# EAGLE schematic raspdancer11_1.0 (EAGLE 6.4)
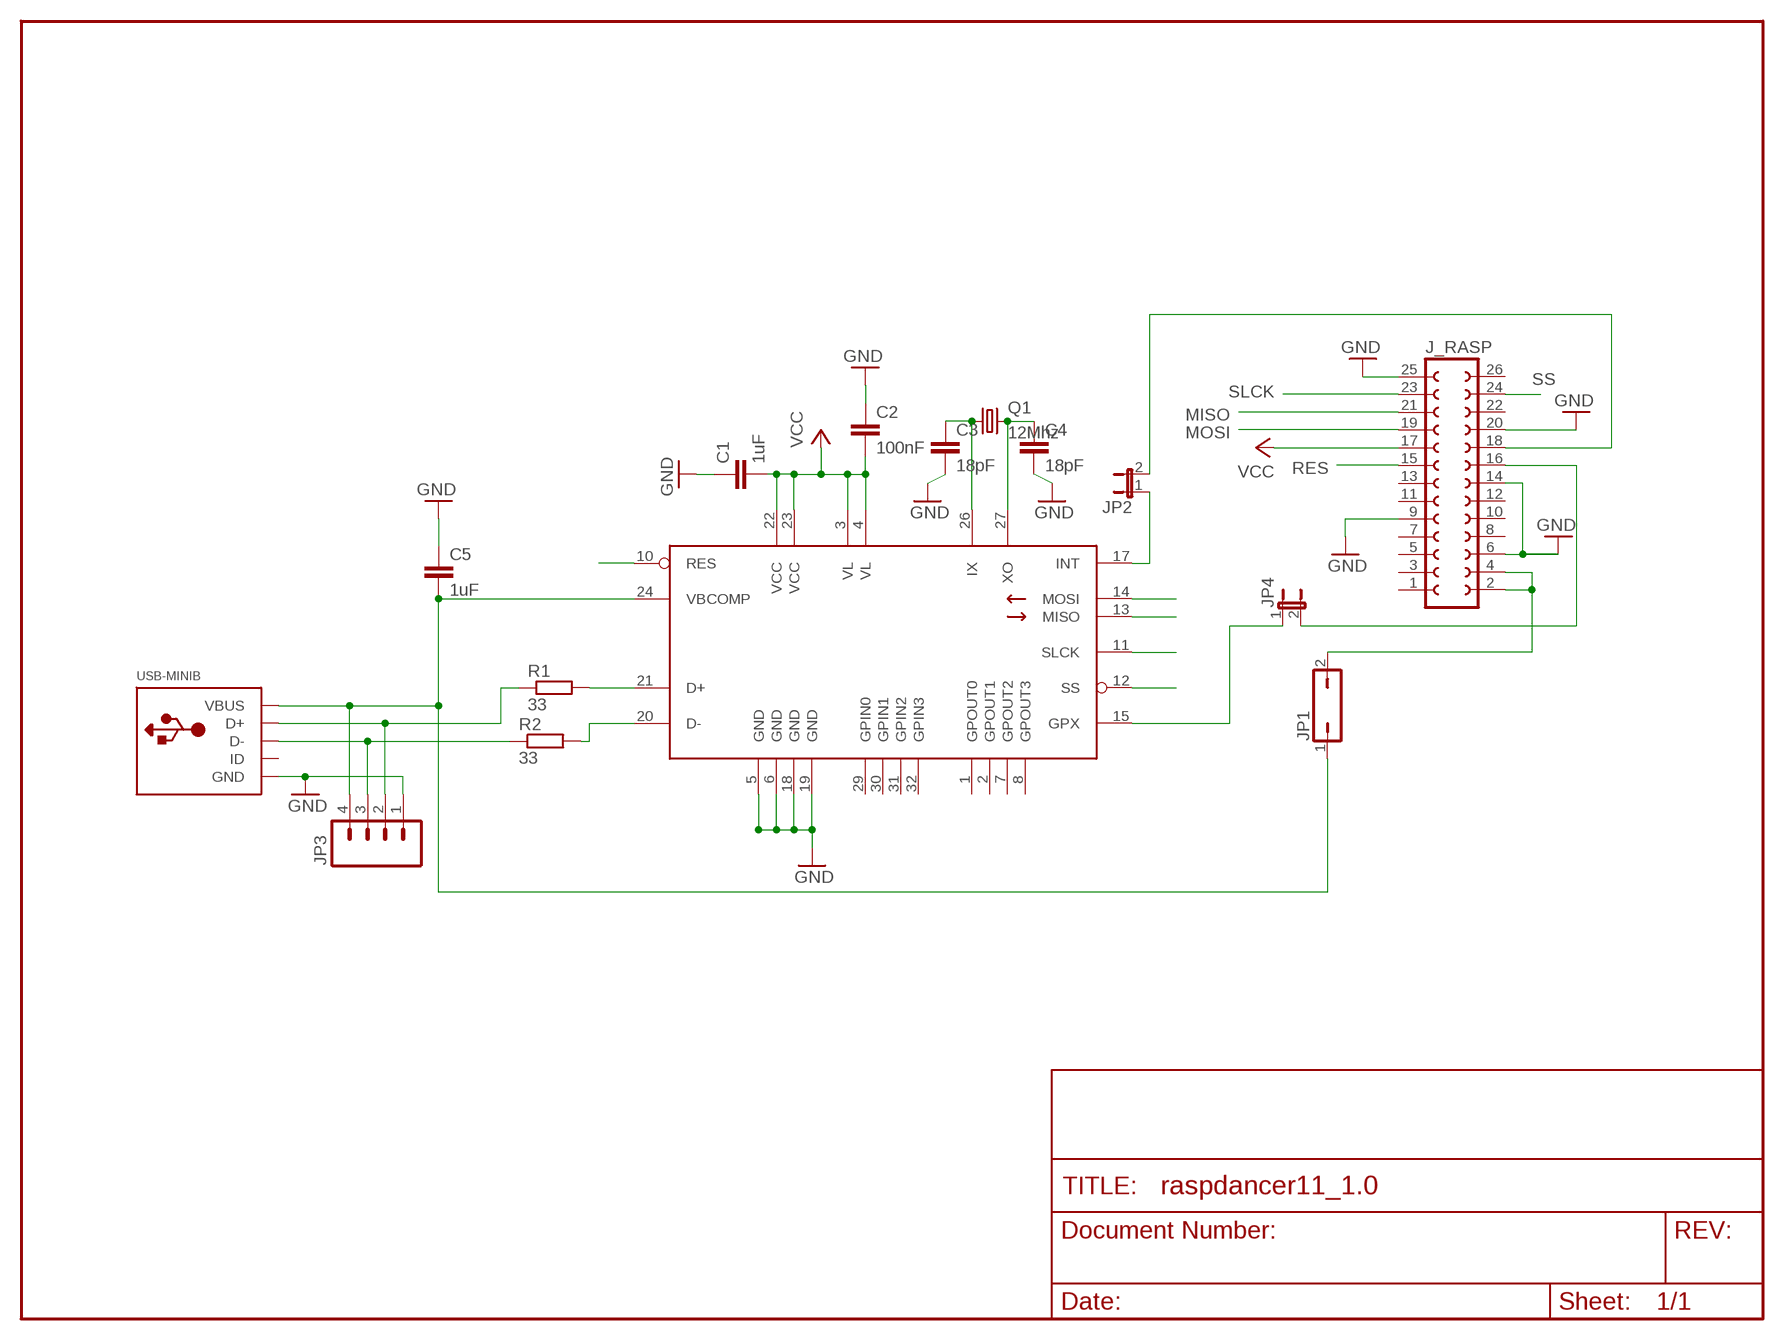
[diagram p0: schematic, sheet 1]

## Parts
C1  1uF  C1206  [C1206]
C2  100nF  C1206  [C1206]
C3  18pF  C1206  [C1206]
C4  18pF  C1206  [C1206]
C5  1uF  C1206  [C1206]
IC1  MAX3420  [TQFP32-08]
J_RASP  FE13-2  [FE13-2]
JP1  JP1Q  [JP1]
JP2  JUMPER-2-OLDSMD-NO  [SJ_2S-NO]
JP3  M04PTH  [1X04]
JP4  JUMPER-2-OLDSMD-NO  [SJ_2S-NO]
Q1  12Mhz  CRYSTALCTS406  [CTS406]
R1  33  R1206  [R1206]
R2  33  R1206  [R1206]
USB-MINIB  USBMINIB  [USB-MINIB]

## Nets
D+: IC1.21(D+) R1.2
D+2: JP3.2 R1.1 USB-MINIB.D+
D-: IC1.20(D-) R2.2
D-2: JP3.3 R2.1 USB-MINIB.D-
GND: C1.1 C2.1 C3.2 C4.2 C5.1 IC1.5(GND) IC1.6(GND) IC1.18(GND) IC1.19(GND) J_RASP.6 J_RASP.9 J_RASP.14 J_RASP.20 J_RASP.25 JP3.1
GPX: IC1.15(GPX) JP4.1
GPX2: J_RASP.16 JP4.2
INT: IC1.17(INT) JP2.1
INT2: J_RASP.18 JP2.2
IX: C3.1 IC1.26(IX) Q1.1
MISO: IC1.13(MISO) J_RASP.21
MOSI: IC1.14(MOSI) J_RASP.19
RES: IC1.10(RES) J_RASP.15
SLCK: IC1.11(SLCK) J_RASP.23
SS: IC1.12(SS) J_RASP.24
VBUS: C5.2 IC1.24(VBCOMP) JP1.1 JP3.4 USB-MINIB.VBUS
VBUS2: J_RASP.2 J_RASP.4 JP1.2
VCC: C1.2 C2.2 IC1.3(VL) IC1.4(VL) IC1.22(VCC) IC1.23(VCC) J_RASP.17
XO: C4.1 IC1.27(XO) Q1.3
Unconnected: IC1.1(GPOUT0) IC1.2(GPOUT1) IC1.7(GPOUT2) IC1.8(GPOUT3) IC1.29(GPIN0) IC1.30(GPIN1) IC1.31(GPIN2) IC1.32(GPIN3) J_RASP.1 J_RASP.3 J_RASP.5 J_RASP.7 J_RASP.8 J_RASP.10 J_RASP.11 J_RASP.12 J_RASP.13 J_RASP.22 J_RASP.26 USB-MINIB.ID

## Power pins joined to a net without a drawn wire
GND: USB-MINIB.GND

## Library data of the parts
C1-C5 = 00_mylib:C
IC1 = maxim-2:MAX3420
J_RASP = con-lsta:FE13-2: FEMALE HEADER; OC_FARNELL: unknown; OC_NEWARK: unknown
JP1 = jumper:JP1Q: JUMPER
JP2 JP4 = SparkFun:JUMPER-2-OLD: Jumper Basic 0.1" spaced jumper. Use with breakaway headers.
JP3 = SparkFun:M04: Header 4 Standard 4-pin 0.1" header. Use with straight break away headers (SKU : PRT-00116), right angle break away headers (PRT-00553), swiss pins (PRT-00743), machine pins (PRT-00117), and female headers (PRT-00115). Molex polarized connector foot print use with SKU : PRT-08231 with associated crimp pins and housings. 1MM SMD Version SKU: PRT-10208
Q1 = crystal:CRYSTAL: CRYSTAL; OC_FARNELL: unknown; OC_NEWARK: unknown
R1 R2 = 00_mylib:R: Resistance
USB-MINIB = adafruit:USB: USB Connectors USBMINIB - Surface Mount Female Mini-B USB Connector 4UConnector: 06564 By microbuilder.eu Thru-hole RA Female Mini-B USB Connector 4UConnector: 18732 By ladyada.net